# Altium schematic sheet SunS_Top.SchDoc: Sun Sensor build with digital ALS
size A3; Author: Michał Gumiela; SheetNumber: 1; SheetTotal: 9; PageSetup: Record=PageOptions|CenterHorizontal=True|CenterVertical=True|PrintScale=0.71|XCorrection=1.00|YCorrection=1.00|PrintKind=0|BorderSize=5000000|LeftOffset=0|BottomOffset=0|Orientation=2|PaperLength=1000|PaperWidth=1000|Scale=100|PaperSource=7|PrintQuality=-3|MediaType=1|DitherType=10|PrintScaleMode=1|PaperKind=A4|PaperIndex=9
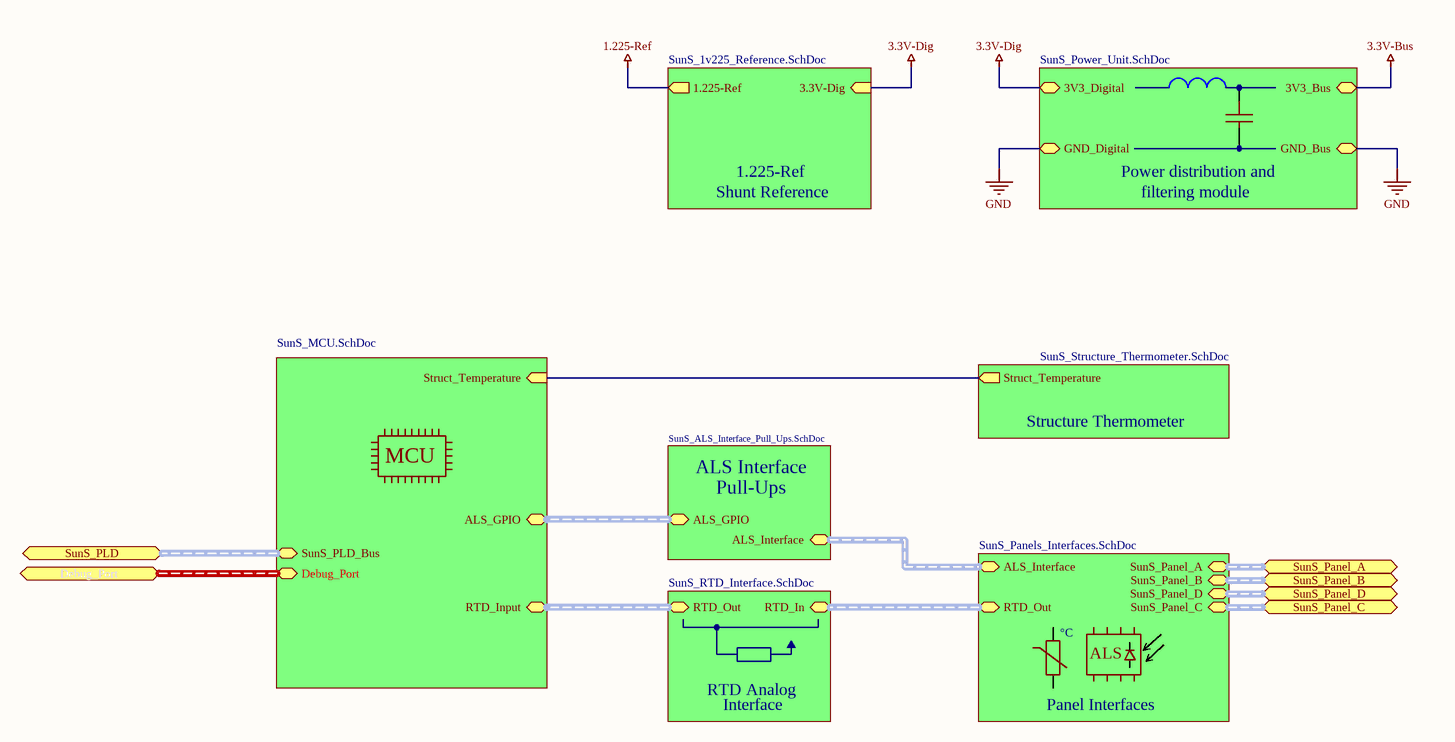
[diagram p0: SunS_Top.SchDoc]

## Sub-sheets
1V225_Reference = SunS_1v225_Reference.SchDoc: 3.3V-Dig (in), 1.225-Ref (out)
ALS Interface Pull-Ups = SunS_ALS_Interface_Pull_Ups.SchDoc: ALS_Interface (harness SunS_ALS_Interface), ALS_GPIO (harness SunS_ALS_GPIO)
Microcontroller Unit = SunS_MCU.SchDoc: RTD_Input (harness SunS_RTD_Interface), ALS_GPIO (harness SunS_ALS_GPIO), SunS_PLD_Bus (harness SunS_PLD_Bus), Struct_Temperature (in), Debug_Port (harness SunS-Debug-Port)
PANELS_CONN = SunS_Panels_Interfaces.SchDoc: ALS_Interface (harness SunS_ALS_Interface), RTD_Out (harness SunS_RTD_Interface), SunS_Panel_A (harness Panel-A), SunS_Panel_B (harness Panel-B), SunS_Panel_C (harness Panel-C), SunS_Panel_D (harness Panel-D)
Power Unit = SunS_Power_Unit.SchDoc: 3V3_Digital, 3V3_Bus, GND_Bus, GND_Digital
RTD Analog Interface = SunS_RTD_Interface.SchDoc: RTD_In (harness SunS_RTD_Interface), RTD_Out (harness SunS_RTD_Interface)
Structure Thermometer = SunS_Structure_Thermometer.SchDoc: Struct_Temperature (out)

## Ports
Debug_Port (harness SunS_PLD_I2C), SunS_Panel_A (harness SunS_Panel_A), SunS_Panel_B (harness SunS_Panel_B), SunS_Panel_C (harness SunS_Panel_C), SunS_Panel_D (harness SunS_Panel_D), SunS_PLD (harness SunS_PLD_Bus)

## Nets
1.225-Ref: sheet 1V225_Reference/1.225-Ref
3.3V-Bus: sheet Power Unit/3V3_Bus
3.3V-Dig: sheet Power Unit/3V3_Digital, sheet 1V225_Reference/3.3V-Dig
GND: sheet Power Unit/GND_Bus, sheet Power Unit/GND_Digital
(unnamed): sheet Microcontroller Unit/Struct_Temperature, sheet Structure Thermometer/Struct_Temperature

## Buses and harness runs
harness port Debug_Port = sheet Microcontroller Unit/Debug_Port
harness port SunS_Panel_A = sheet PANELS_CONN/SunS_Panel_A
harness port SunS_Panel_B = sheet PANELS_CONN/SunS_Panel_B
harness port SunS_Panel_C = sheet PANELS_CONN/SunS_Panel_C
harness port SunS_Panel_D = sheet PANELS_CONN/SunS_Panel_D
harness port SunS_PLD = sheet Microcontroller Unit/SunS_PLD_Bus
harness sheet ALS Interface Pull-Ups/ALS_GPIO = sheet Microcontroller Unit/ALS_GPIO
harness sheet ALS Interface Pull-Ups/ALS_Interface = sheet PANELS_CONN/ALS_Interface
harness sheet Microcontroller Unit/RTD_Input = sheet RTD Analog Interface/RTD_Out
harness sheet PANELS_CONN/RTD_Out = sheet RTD Analog Interface/RTD_In

## Notes on the sheet
- Shunt Reference
- 1.225-Ref
- Power distribution and
- filtering module
- MCU
- ALS Interface
- Pull-Ups
- °C
- ALS
- RTD Analog
- Interface
- Panel Interfaces
- Title:
- Project:
- Author:
- Model:
- Document Number:
- Checked by:
- Rev:
- Date:
- Approved by:
- Sheet:
- of
- File name: